# EAGLE schematic documentation schema (EAGLE 9.3.1)
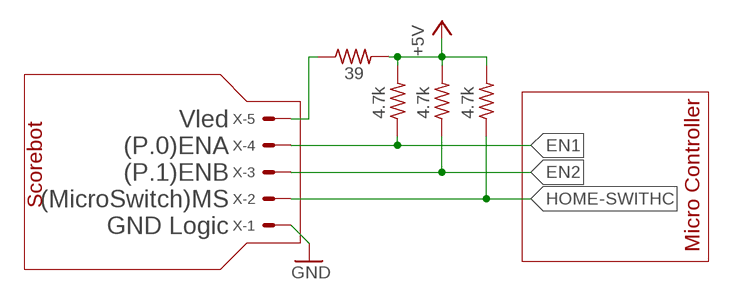
[diagram p0: schematic, sheet 1]

## Parts
R1  39  R-US_0204/5  [0204/5]
R2  4.7k  R-US_0204/5  [0204/5]
R3  4.7k  R-US_0204/5  [0204/5]
R4  4.7k  R-US_0204/5  [0204/5]
X  22-23-2051  [22-23-2051]

## Nets
+5V: R1.2 R2.2 R3.2 R4.2
EN1: R4.1 X.4
EN2: R3.1 X.3
GND: X.1
HOME-SWITHC: R2.1 X.2
N$4: R1.1 X.5

## Notes on the sheet
- Vled
- (P.0)ENA
- (P.1)ENB
- (MicroSwitch)MS
- Scorebot
- GND Logic
- Micro Controller

## Library data of the parts
R1-R4 = rcl:R-US_: RESISTOR, American symbol; SPICEPREFIX: R
X = con-molex:22-23-2051: .100" (2.54mm) Center Header - 5 Pin; MF: MOLEX; MPN: 22-23-2051; OC_FARNELL: 1462952; OC_NEWARK: 38C9178